# Altium schematic sheet Sensor.SchDoc
size A; SheetNumber: 5; SheetTotal: 5
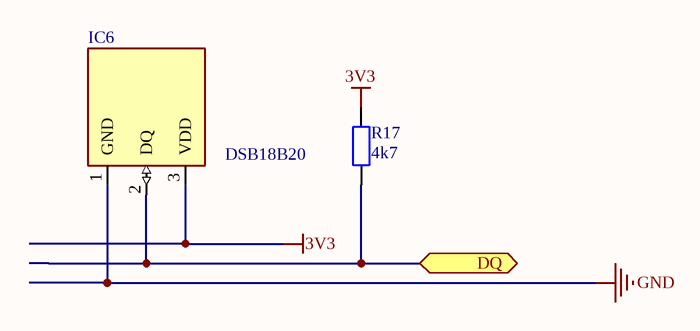
[diagram p0: Sensor.SchDoc]

## Parts
IC6  DSB18B20  [TO-92]
R17  4k7  [RES-SMD-0805]

## Ports
DQ (bidir)

## Nets
3V3: IC6.3(VDD) R17.2
GND: IC6.1(GND)
DQ: IC6.2(DQ) R17.1 ; port DQ

## Library data of the parts
IC6 = DSB18B20: https://linhkien.cxt.vn/3083-ds18b20-temperature-sensors-55-to-125-c-to-92-3.html
R17 = Resistor - SMD: Resistor SMD; Manufacturer: Generic Components; Class: Passive; Published: 08/06/2000; Publisher: Altium Hobart Technology Centre